# Altium schematic sheet MTCH9010_Sensors_Revision_History.SchDoc
size A3; SheetTitle: Revision History; CompanyName: Microchip Technology Inc.; Organization: Microchip Technology; Address1: 2355 West Chandler Blvd.; Address2: Chandler, AZ  85224; Address4: USA; SheetNumber: 2; SheetTotal: 2; Time: Time
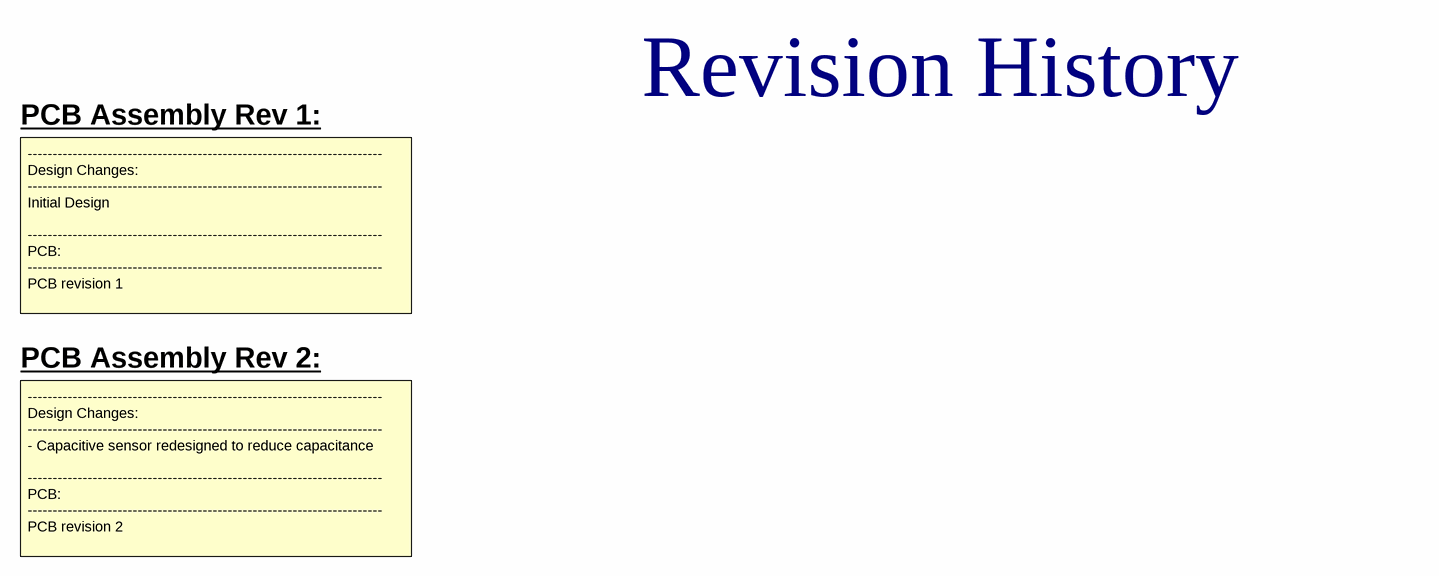
[diagram p0: MTCH9010_Sensors_Revision_History.SchDoc]

## Notes on the sheet
- Revision History
- PCB Assembly Rev 1:
- -----------------------------------------------------------------------
  Design Changes:
  -----------------------------------------------------------------------
  Initial Design
  -----------------------------------------------------------------------
  PCB:
  -----------------------------------------------------------------------
  PCB revision 1
- PCB Assembly Rev 2:
- -----------------------------------------------------------------------
  Design Changes:
  -----------------------------------------------------------------------
  - Capacitive sensor redesigned to reduce capacitance
  -----------------------------------------------------------------------
  PCB:
  -----------------------------------------------------------------------
  PCB revision 2
- Project Owner:
- PCB Layout Contact:
- PartNumber:
- Project Title
- Variant:
- Sheet Title
- Size
- A3
- SCH #:
- PCB #:
- Rev:
- Date:
- Sheet
- Designed with
- Altium.com <http://go.altium.com/MicrochipLandingPage_Evaluation.html>
- File: